# EAGLE design DuoTristateBuffer (EAGLE 8.0.2)
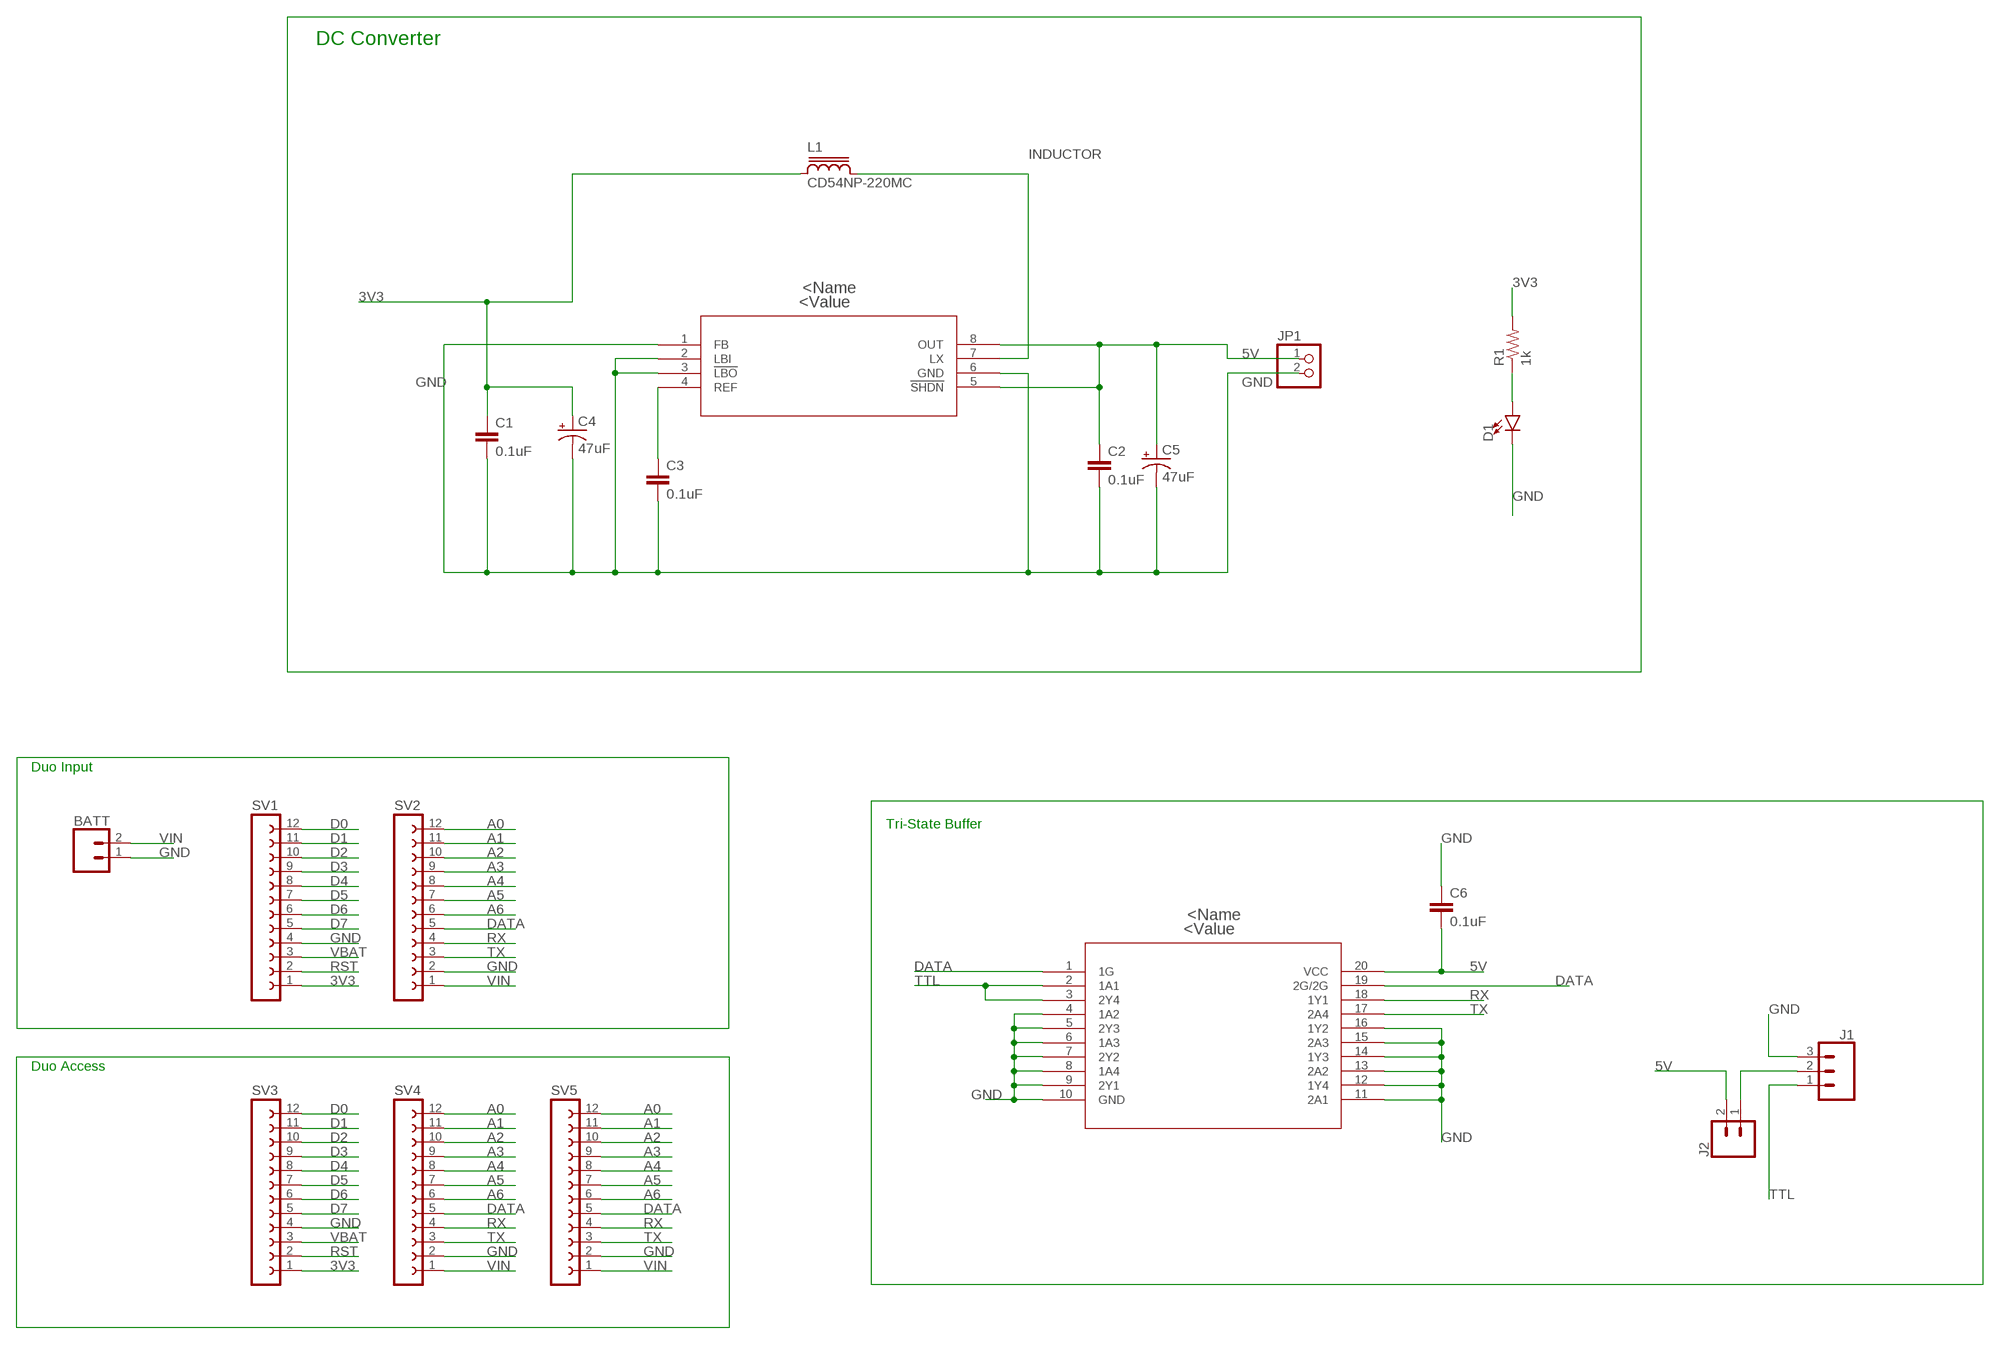
[diagram p0: schematic, sheet 1]

## Parts
BATT  CONN_02-JST-2-PTH-NO_SILK  [JST-2-PTH-NS]
BUFFER  SN74LS241_DW_20DW20-M  [DW20-M]
C1  0.1uF  0.1UF-0603-25V-5%  [0603]
C2  0.1uF  0.1UF-0603-25V-5%  [0603]
C3  0.1uF  0.1UF-0603-25V-5%  [0603]
C4  47uF  47UF-POLAR-EIA3528-10V-10%  [EIA3528]
C5  47uF  47UF-POLAR-EIA3528-10V-10%  [EIA3528]
C6  0.1uF  0.1UF-0603-25V-5%  [0603]
D1  LED3MM  [LED_3MM]
J1  CONN_03  [1X03]
J2  CONN_02  [1X02]
JP1  PINHD-1X2/90  [1X02/90]
L1  CD54NP-220MC  CD54  [CD54]
R1  1k  R-US_R2010  [R2010]
SV1  FE12-1  [FE12]
SV2  FE12-1  [FE12]
SV3  FE12-1  [FE12]
SV4  FE12-1  [FE12]
SV5  FE12-1  [FE12]
U1  MAX1674EUA+T  [21-0036K]

## Nets
3V3: C1.1 C4.A(+) L1.1 R1.2 SV1.1 SV3.1
5V: BUFFER.20(VCC) C2.1 C5.A(+) C6.2 J2.2 JP1.1 U1.5(!SHDN) U1.8(OUT)
A0: SV2.12 SV4.12 SV5.12
A1: SV2.11 SV4.11 SV5.11
A2: SV2.10 SV4.10 SV5.10
A3: SV2.9 SV4.9 SV5.9
A4: SV2.8 SV4.8 SV5.8
A5: SV2.7 SV4.7 SV5.7
A6: SV2.6 SV4.6 SV5.6
D0: SV1.12 SV3.12
D1: SV1.11 SV3.11
D2: SV1.10 SV3.10
D3: SV1.9 SV3.9
D4: SV1.8 SV3.8
D5: SV1.7 SV3.7
D6: SV1.6 SV3.6
D7: SV1.5 SV3.5
DATA: BUFFER.1(1G) BUFFER.19(2G/2G) SV2.5 SV4.5 SV5.5
GND: BATT.1 BUFFER.4(1A2) BUFFER.5(2Y3) BUFFER.6(1A3) BUFFER.7(2Y2) BUFFER.8(1A4) BUFFER.9(2Y1) BUFFER.10(GND) BUFFER.11(2A1) BUFFER.12(1Y4) BUFFER.13(2A2) BUFFER.14(1Y3) BUFFER.15(2A3) BUFFER.16(1Y2) C1.2 C2.2 C3.2 C4.C(-) C5.C(-) C6.1 D1.K(C) J1.3 JP1.2 SV1.4 SV2.2 SV3.4 SV4.2 SV5.2 U1.1(FB) U1.2(LBI) U1.3(!LBO) U1.6(GND)
INDUCTOR: L1.2 U1.7(LX)
N$1: J1.2 J2.1
N$3: D1.A R1.1
REF: C3.1 U1.4(REF)
RST: SV1.2 SV3.2
RX: BUFFER.18(1Y1) SV2.4 SV4.4 SV5.4
TTL: BUFFER.2(1A1) BUFFER.3(2Y4) J1.1
TX: BUFFER.17(2A4) SV2.3 SV4.3 SV5.3
VBAT: SV1.3 SV3.3
VIN: BATT.2 SV2.1 SV4.1 SV5.1

## Notes on the sheet
- DC Converter
- Duo Input
- Tri-State Buffer
- Duo Access

## Library data of the parts
BATT J2 = SparkFun-Connectors:CONN_02: Multi connection point. Often used as Generic Header-pin footprint for 0.1 inch spaced/style header connections On any of the 0.1 inch spaced packages, you can populate with these: Break Away Headers - Straight <https://www.sparkfun.com/products/116> (PRT-00116) Break Away Male Headers - Right Angle <https://www.sparkfun.com/products/553> (PRT-00553) Female Headers <https://www.sparkfun.com/products/115> (PRT-00115) Break Away Headers - Machine Pin <https://www.sparkfun.com/products/117> (PRT-00117) Break Away Female Headers - Swiss Machine Pin <https://www.sparkfun.com/products/743> (PRT-00743) For SCREWTERMINALS and SPRING TERMINALS visit here: Screw Terimnals on SparkFun.com <https://www.sparkfun.com/search/results?term=Screw+Terminals> (5mm/3.5mm/2.54mm spacing) This device is also useful as a general connection point to wire up your design to another part of your project. Our various solder wires solder well into these plated through hole pads. Hook-Up Wire - Assortment (Stranded, 22 AWG) <https://www.sparkfun.com/products/11375> (PRT-11375) Hook-Up Wire - Assortment (Solid Core, 22 AWG) <https://www.sparkfun.com/products/11367> (PRT-11367) View the entire wire category on our website here <https://www.sparkfun.com/categories/141> Special notes: Molex polarized connector foot print use with: PRT-08233 with associated crimp pins and housings. 2.54_SCREWTERM for use with PRT-10571. 3.5mm Screw Terminal footprints for PRT-08084 5mm Screw Terminal footprints for use with PRT-08432
BUFFER = SN74LS241:SN74LS241_DW_20: SN74LS241 Tri-State Buffer
C1-C3 C6 = SparkFun-Capacitors:0.1UF: 0.1µF ceramic capacitors A capacitor is a passive two-terminal electrical component used to store electrical energy temporarily in an electric field.; PROD_ID: CAP-08604
C4 C5 = SparkFun-Capacitors:47UF-POLAR: 47µF polarized capacitors A capacitor is a passive two-terminal electrical component used to store electrical energy temporarily in an electric field.; PROD_ID: CAP-08310
D1 = SparkFun-LED:LED: LED (Generic) Standard schematic elements and footprints for 5mm, 3mm, 1206, and 0603 sized LEDs. Generic LEDs with no color specified.; PROD_ID: DIO-08794
J1 = SparkFun-Connectors:CONN_03: Multi connection point. Often used as Generic Header-pin footprint for 0.1 inch spaced/style header connections On any of the 0.1 inch spaced packages, you can populate with these: Break Away Headers - Straight <https://www.sparkfun.com/products/116> (PRT-00116) Break Away Male Headers - Right Angle <https://www.sparkfun.com/products/553> (PRT-00553) Female Headers <https://www.sparkfun.com/products/115> (PRT-00115) Break Away Headers - Machine Pin <https://www.sparkfun.com/products/117> (PRT-00117) Break Away Female Headers - Swiss Machine Pin <https://www.sparkfun.com/products/743> (PRT-00743) Stackable Header - 3 Pin (Female, 0.1") <https://www.sparkfun.com/products/13875> (PRT-13875) For SCREWTERMINALS and SPRING TERMINALS visit here: Screw Terimnals on SparkFun.com <https://www.sparkfun.com/search/results?term=Screw+Terminals> (5mm/3.5mm/2.54mm spacing) This device is also useful as a general connection point to wire up your design to another part of your project. Our various solder wires solder well into these plated through hole pads. Hook-Up Wire - Assortment (Stranded, 22 AWG) <https://www.sparkfun.com/products/11375> (PRT-11375) Hook-Up Wire - Assortment (Solid Core, 22 AWG) <https://www.sparkfun.com/products/11367> (PRT-11367) View the entire wire category on our website here <https://www.sparkfun.com/categories/141> Special notes: Molex polarized connector foot print use with SKU : PRT-08232 with associated crimp pins and housings.
JP1 = pinhead:PINHD-1X2: PIN HEADER
L1 = inductor-sumida:CD54: POWER INDUCTOR
R1 = resistor:R-US_: RESISTOR, American symbol
SV1-SV5 = con-lsta:FE12-1: FEMALE HEADER; OC_FARNELL: unknown; OC_NEWARK: unknown
U1 = Maxim:MAX1674EUA+T: MAX1674 Maxim DC Boost-up Converter; MANUFACTURER_PART_NUMBER: MAX1674EUA+T; VENDOR: Maxim

## Board
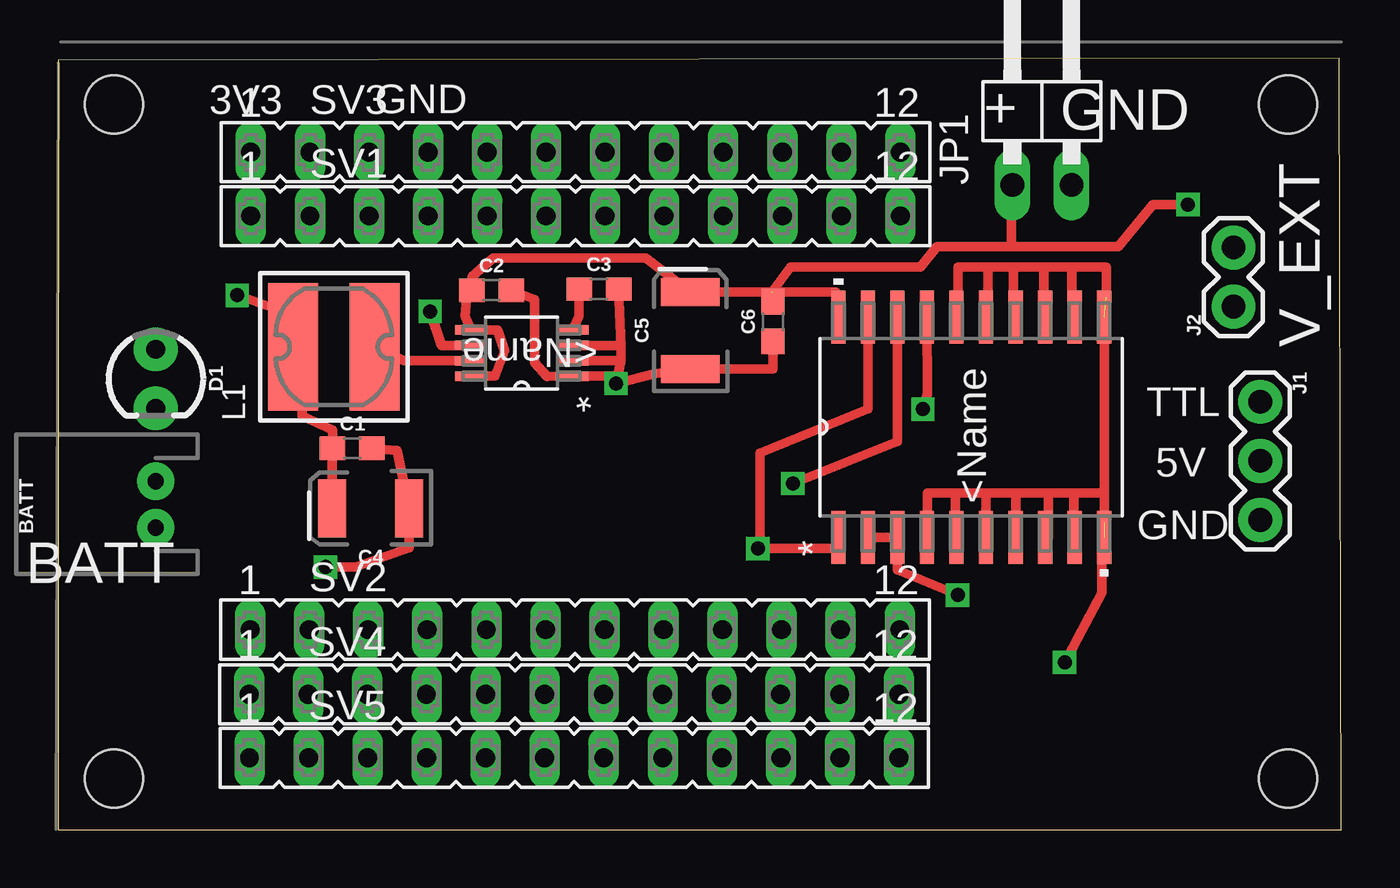
[diagram p1: board, top side]
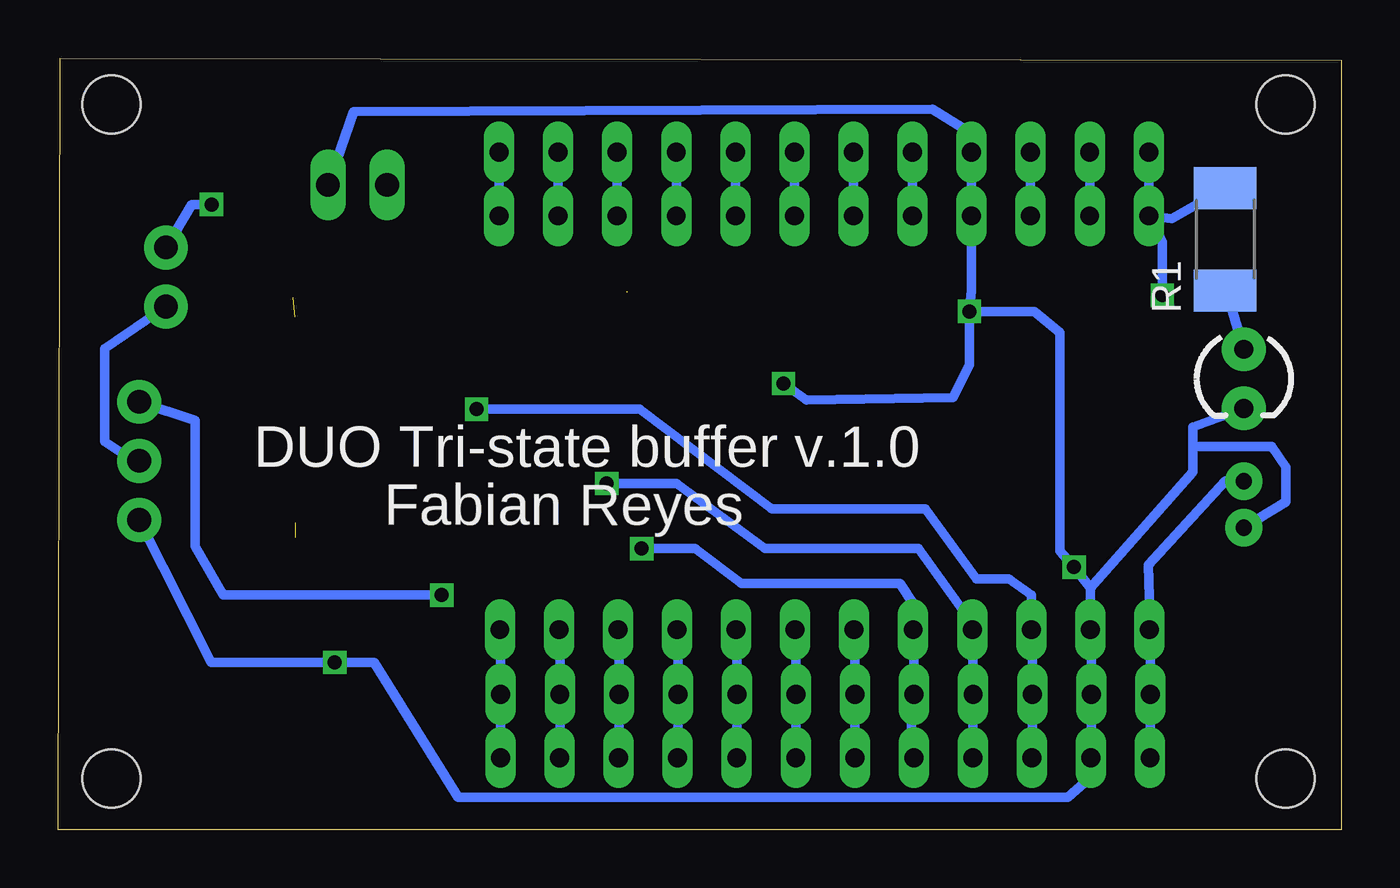
[diagram p2: board, bottom side, seen from below]

Size 55.2 x 33.2 mm. Coordinates in mm from the lower left corner, seen from the top.
Outline: 0,0 55.2,0 55.1,33.2 0,33.1 0,0
Copper layers (1*16): Top 0.035mm / dielectric 1.5mm / Bottom 0.035mm
Design rules "default *": minimum track width 6mil, minimum drill 0.3mm, track to track 6mil, track to pad 6mil, pad to pad 10mil, via to via 10mil, smd to smd 8mil, copper to edge 40mil, drill to drill 10mil, minimum pad ring 10mil, minimum via ring 8mil, stop-mask expansion 4mil, vias tented up to drill 0mil, thermal gap 10mil
Holes 2.5 mm at 2.4,31.2 2.4,2.2 52.9,2.2 52.9,31.2

### Footprints (pad centres in the part's own frame; a part is rotated, then mirrored left to right if it is on the bottom)
JST-2-PTH-NS = drill 0.7 pad 1.6: 1 -1,0; 2 1,0
DW20-M = smd 2.286 x 0.61: 1 -4.737,5.715; 2 -4.737,4.445; 3 -4.737,3.175; 4 -4.737,1.905; 5 -4.737,0.635; 6 -4.737,-0.635; 7 -4.737,-1.905; 8 -4.737,-3.175; 9 -4.737,-4.445; 10 -4.737,-5.715; 11 4.737,-5.715; 12 4.737,-4.445; 13 4.737,-3.175; 14 4.737,-1.905; 15 4.737,-0.635; 16 4.737,0.635; 17 4.737,1.905; 18 4.737,3.175; 19 4.737,4.445; 20 4.737,5.715
0603 = smd 1.1 x 1: 1 -0.85,0; 2 0.85,0
EIA3528 = smd 1.2 x 2.5: A 1.65,0; C -1.65,0
LED_3MM = drill 0.813 pad 1.88: A -1.27,0; K 1.27,0
1X03 = drill 1.016 pad 1.88: 1 0,0; 2 2.54,0; 3 5.08,0
1X02 = drill 1.016 pad 1.88: 1 0,0; 2 2.54,0
1X02/90 = drill 1.016 long: 1 -1.27,-3.81; 2 1.27,-3.81
CD54 = smd 5.5 x 2.15: 1 0,1.75; 2 0,-1.75
R2010 = smd 1.8 x 2.7: 1 -2.2,0; 2 2.2,0
FE12 = drill 0.813 long: 1 -13.97,0; 2 -11.43,0; 3 -8.89,0; 4 -6.35,0; 5 -3.81,0; 6 -1.27,0; 7 1.27,0; 8 3.81,0; 9 6.35,0; 10 8.89,0; 11 11.43,0; 12 13.97,0
21-0036K = smd 1.372 x 0.406: 1 -2.184,0.991; 2 -2.184,0.33; 3 -2.184,-0.33; 4 -2.184,-0.991; 5 2.184,-0.991; 6 2.184,-0.33; 7 2.184,0.33; 8 2.184,0.991

### Placement (x,y rotation side)
BATT  4.2,14 90 top
BUFFER  39.28,17.32 90 top
C1  12.65,16.41 0 top
C2  18.64,23.21 0 top
C3  23.26,23.26 0 top
C4  13.44,13.83 180 top
C5  27.19,21.48 90 top
C6  30.75,21.86 90 top
D1  4.2,19.4 270 top
J1  51.71,18.41 270 top
J2  50.56,22.51 90 top
JP1  42.32,31.55 0 top
L1  11.86,20.78 90 top
R1  5,25.4 90 bottom
SV1  22.26,26.41 0 top
SV2  22.23,8.61 0 top
SV3  22.26,29.15 0 top
SV4  22.19,5.83 0 top
SV5  22.2,3.1 0 top
U1  19.94,20.51 180 top

### Tracks (layer width: path | path; a pad name or v marks a point on that pad's centre or on a via)
3V3  (via drill 0.6)
  Top 0.406: v7.7,23 9.71,22.3 L1.1 10.5,20.78 10.5,17.8 11.8,17.2 C1.1 C4.A
  Bottom 0.406: SV1.1 SV3.1 | SV1.1 7.7,25.31 v7.7,23 | R1.2 7.29,26.3 SV1.1
5V  (via drill 0.6)  (1 unrouted)
  Top 0.406: U1.8 18.8,19.52 19.2,20.6 18.9,21.5 U1.5 17.5,22.1 17.6,23.1 17.79,23.4 C2.1 17.8,23.81 18.7,24.6 25.29,24.6 C5.A 30.7,23.13 | 30.7,23.13 33.46,23.13 BUFFER.20 | C6.2 30.75,23.13 | 30.7,23.13 31.5,24.2 37.1,24.2 37.8,25.1 41,25.1 | 41,25.1 45.6,25.1 47.1,26.9 v48.6,26.9 | JP1.1 41,27.74 41,25.1
  Bottom 0.406: v48.6,26.9 49.46,26.9 J2.2
A0
  Bottom 0.406: SV2.12 36.16,8.61 SV4.12 SV5.12
A1
  Bottom 0.406: SV2.11 33.62,8.61 SV4.11 SV5.11
A2
  Bottom 0.406: SV2.10 31.08,8.61 SV4.10 SV5.10
A3
  Bottom 0.406: SV2.9 28.54,8.61 SV4.9 SV5.9
A4
  Bottom 0.406: SV2.8 26,8.61 SV4.8 SV5.8
A5
  Bottom 0.406: SV2.7 23.46,8.61 SV4.7 SV5.7
A6
  Bottom 0.406: SV2.6 20.92,8.61 SV4.6 SV5.6
D0
  Bottom 0.406: SV3.12 SV1.12
D1
  Bottom 0.406: SV3.11 SV1.11
D2
  Bottom 0.406: SV3.10 SV1.10
D3
  Bottom 0.406: SV3.9 SV1.9
D4
  Bottom 0.406: SV3.8 SV1.8
D5
  Bottom 0.406: SV3.7 SV1.7
D6
  Bottom 0.406: SV3.6 SV1.6
D7
  Bottom 0.406: SV3.5 SV1.5
DATA  (via drill 0.6)
  Top 0.406: 30.2,12.1 33.56,12.1 BUFFER.1 | v30.1,12.1 30.2,12.1 | 30.2,12.1 30.2,16.2 34.84,18.1 BUFFER.19
  Bottom 0.406: v30.1,12.1 27.8,12.1 25.8,10.6 19,10.6 18.4,9.71 SV2.5 18.38,8.61 SV4.5 18.38,5.2 18.5,5.2 18.5,3.1 SV5.5
GND  (via drill 0.6)  (2 unrouted)
  Top 0.406: U1.6 16.5,20.84 v16,22.3 | C1.2 14.59,16.31 C4.C 15.1,12.13 12.8,11.3 v11.5,11.3 | v24,19.2 24.21,20.2 | 24.21,20.2 24.21,20.8 | 24.21,20.2 24.21,20.18 U1.2 | 24.21,20.8 C3.2 | U1.3 24.21,20.84 24.21,20.8 | v24,19.2 24.1,19.52 U1.1 21.02,19.5 20.5,20.1 20.5,22.81 C2.2 | v24,19.2 25.7,19.63 C5.C 30.75,19.83 C6.1 | BUFFER.16 38.7,22.06 38.7,24.2 40,24.2 | 41.1,24.2 40,24.2 | 42.4,24.2 41.1,24.2 | 43.6,24.2 42.4,24.2 | 43.6,24.2 45.1,24.2 45.1,22.9 | BUFFER.15 40,22.06 40,24.2 | BUFFER.14 41.1,22.06 41.1,24.2 | BUFFER.13 42.4,22.06 42.4,24.2 | BUFFER.12 43.6,22.06 43.6,24.2 | BUFFER.4 37.4,12.58 37.4,14.5 38.6,14.5 | 39.9,14.5 38.6,14.5 | 41.2,14.5 39.9,14.5 | 42.6,14.5 41.2,14.5 | 43.7,14.5 42.6,14.5 | 43.7,14.5 45,14.5 45,13.2 | BUFFER.5 38.6,12.58 38.6,14.5 | BUFFER.6 39.9,12.58 39.9,14.5 | BUFFER.7 41.2,14.5 | BUFFER.8 42.6,12.58 42.6,14.5 | BUFFER.9 43.7,12.58 43.7,14.5 | v43.3,7.2 44.9,10.2 44.9,12.58 BUFFER.10 BUFFER.11
  Bottom 0.406: v16,22.3 15.91,23.2 SV1.4 SV3.4 15.9,29.95 17.6,31 42.49,30.9 JP1.2 | 10.8,10.4 v11.5,11.3 12.1,12 12.1,21.4 13.2,22.3 v16,22.3 | v16,22.3 16,20 16.7,18.6 23,18.5 v24,19.2 | 10.8,10.4 6.4,15.4 6.4,16.5 | 10.8,10.4 SV2.2 10.76,8.61 SV4.2 SV5.2 10.87,2.2 11.76,1.4 38,1.4 41.6,7.2 v43.3,7.2 48.61,7.2 J1.3 | D1.K 6.4,17.33 6.4,16.5 | BATT.1 2.4,14.1 2.4,15.6 3,16.5 6.4,16.5
INDUCTOR
  Top 0.406: L1.2 14.86,20.18 U1.7
N$1
  Bottom 0.406: J2.1 53.2,20.71 53.2,16.7 52.01,15.9 J1.2
N$3
  Bottom 0.406: R1.1 4.8,22.7 D1.A
REF
  Top 0.406: U1.4 22.41,22.1 C3.1
RST
  Bottom 0.406: SV3.2 SV1.2
RX  (via drill 0.6)
  Top 0.406: v31.6,14.9 36.1,16.7 BUFFER.18
  Bottom 0.406: v31.6,14.9 28.6,14.9 24.8,12.1 18.2,12.1 15.9,8.91 SV2.4 15.84,8.61 SV4.4 SV5.4
TTL  (via drill 0.6)
  Top 0.406: BUFFER.2 BUFFER.3 36.1,11.18 v38.7,10.1
  Bottom 0.406: v38.7,10.1 48.1,10.1 49.3,12.2 49.31,17.6 J1.1
TX  (via drill 0.6)
  Top 0.406: BUFFER.17 37.4,18.76 v37.2,18.1
  Bottom 0.406: v37.2,18.1 30.2,18.1 24.5,13.8 17.9,13.8 15.7,10.8 14.3,10.8 13.34,10.1 SV2.3 13.3,8.61 SV4.3 SV5.3
VBAT
  Bottom 0.406: SV3.3 SV1.3
VIN
  Bottom 0.406: SV5.1 SV4.1 8.22,8.61 SV2.1 8.26,10 8.3,11.4 5,15 BATT.2

### Text on the board
tPlace: GND | 3V3 | + | GND | V_EXT | TTL | 5V | GND | BATT
bPlace: DUO Tri-state buffer v.1.0 | Fabian Reyes
Document: WRONG